# EAGLE design smduino (EAGLE 6.1)
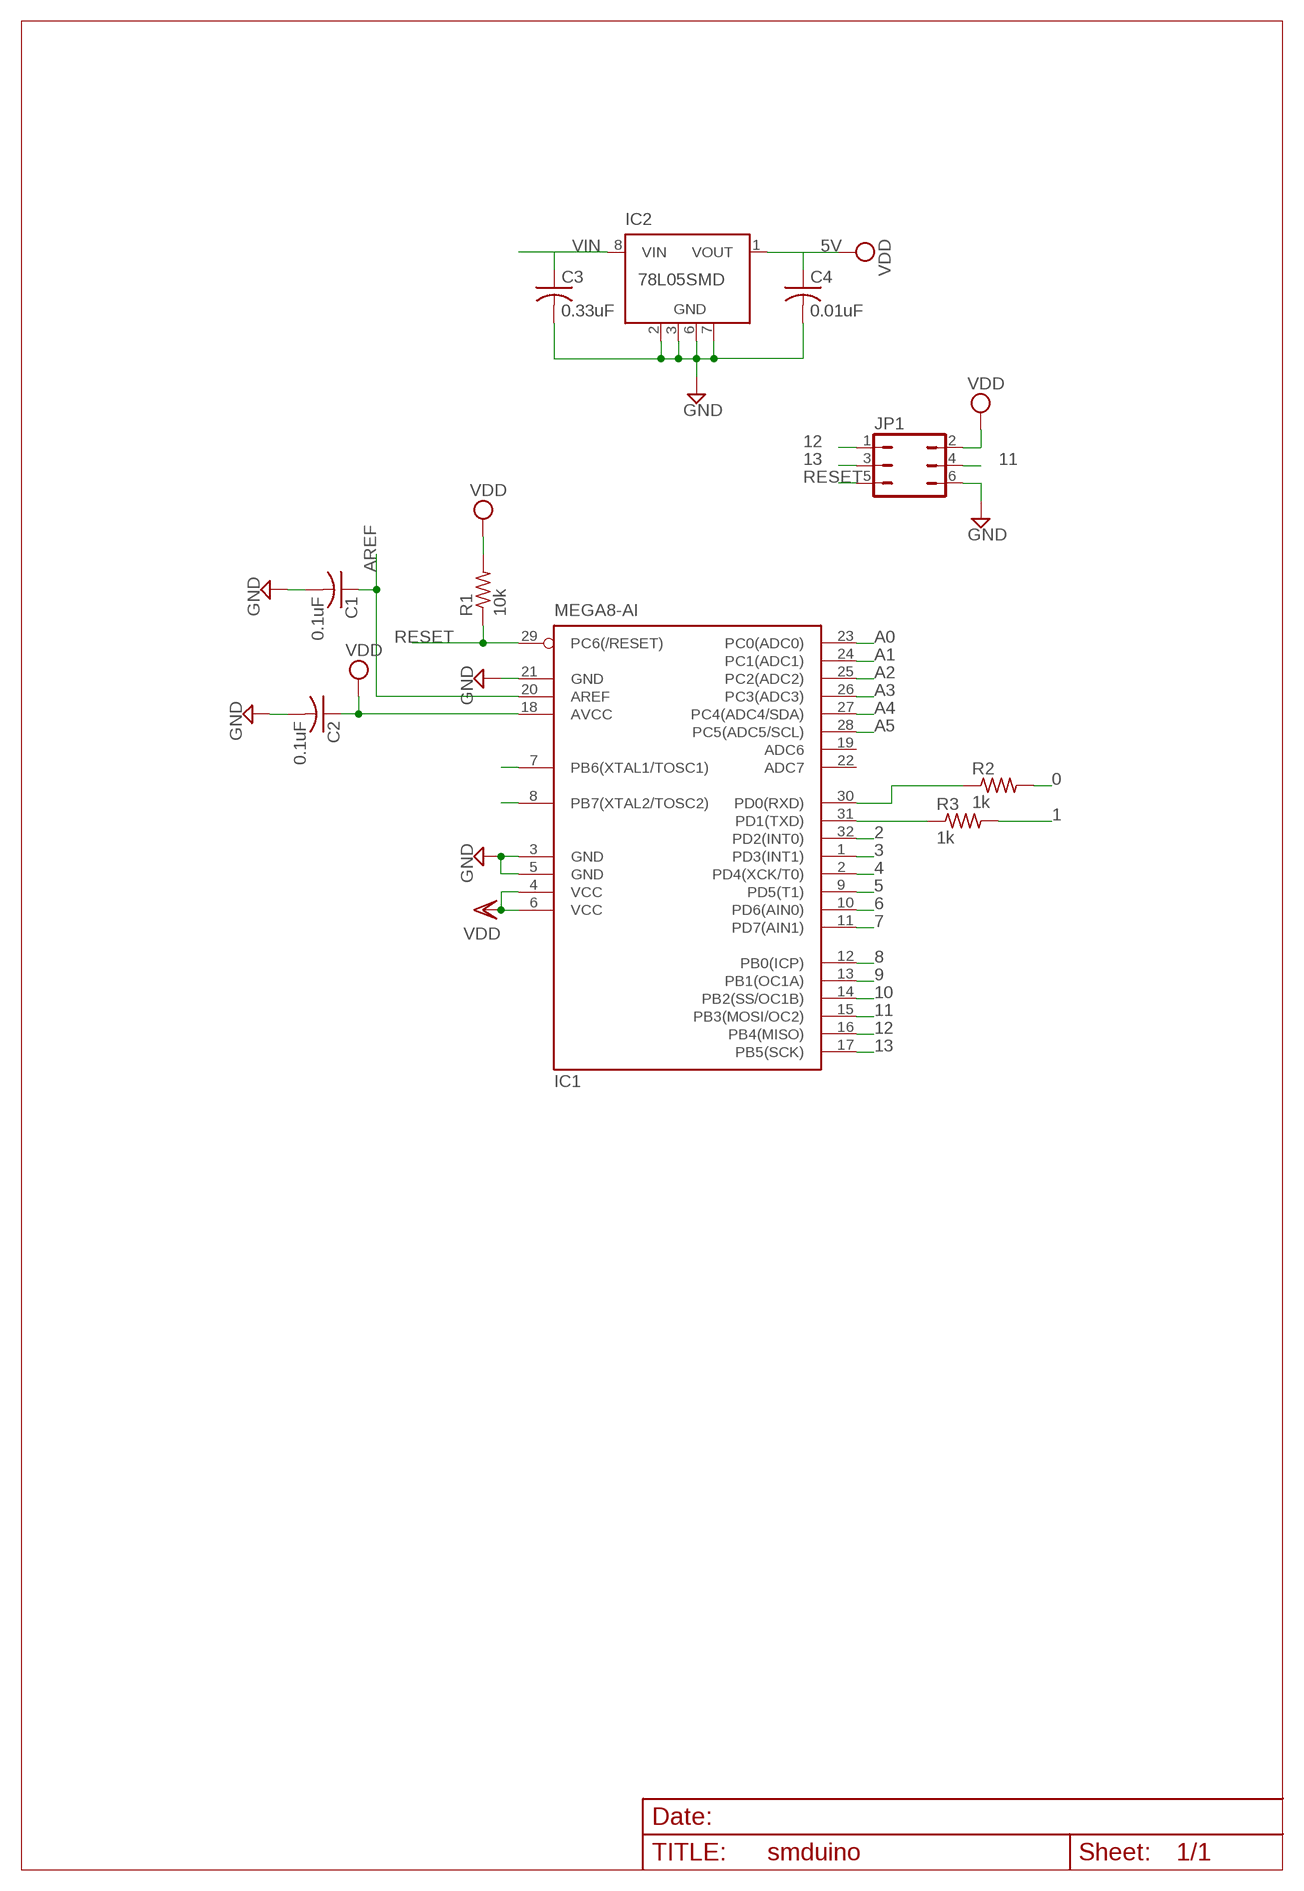
[diagram p0: schematic, sheet 1]

## Parts
C1  0.1uF  C-USC0603  [C0603]
C2  0.1uF  C-USC0603  [C0603]
C3  0.33uF  C-USC0603  [C0603]
C4  0.01uF  C-USC0603  [C0603]
IC1  MEGA8-AI  [TQFP32-08]
IC2  78L05SMD  [SO08]
JP1  JP3Q  [JP3Q]
R1  10k  R-US_R0603  [R0603]
R2  1k  R-US_R0603  [R0603]
R3  1k  R-US_R0603  [R0603]

## Nets
0: R2.2
1: R3.2
2: IC1.32(PD2(INT0))
3: IC1.1(PD3(INT1))
4: IC1.2(PD4(XCK/T0))
5: IC1.9(PD5(T1))
5V: C2.1 C4.1 IC1.4(VCC) IC1.6(VCC) IC1.18(AVCC) IC2.1(VOUT) JP1.2 R1.2 ; supply symbol labelled VDD
6: IC1.10(PD6(AIN0))
7: IC1.11(PD7(AIN1))
8: IC1.12(PB0(ICP))
9: IC1.13(PB1(OC1A))
10: IC1.14(PB2(SS/OC1B))
11: IC1.15(PB3(MOSI/OC2)) JP1.4
12: IC1.16(PB4(MISO)) JP1.1
13: IC1.17(PB5(SCK)) JP1.3
A0: IC1.23(PC0(ADC0))
A1: IC1.24(PC1(ADC1))
A2: IC1.25(PC2(ADC2))
A3: IC1.26(PC3(ADC3))
A4: IC1.27(PC4(ADC4/SDA))
A5: IC1.28(PC5(ADC5/SCL))
AREF: C1.1 IC1.20(AREF)
GND: C1.2 C2.2 C3.2 C4.2 IC1.3(GND) IC1.5(GND) IC1.21(GND) IC2.2(GND) IC2.3(GND) IC2.6(GND) IC2.7(GND) JP1.6
N$1: IC1.30(PD0(RXD)) R2.1
N$2: IC1.31(PD1(TXD)) R3.1
RESET: IC1.29(PC6(/RESET)) JP1.5 R1.1
VIN: C3.1 IC2.8(VIN)
XTAL1: IC1.7(PB6(XTAL1/TOSC1))
XTAL2: IC1.8(PB7(XTAL2/TOSC2))
Unconnected: IC1.19(ADC6) IC1.22(ADC7) IC2.4(NC) IC2.5(NC)

## Library data of the parts
C1-C4 = rcl:C-US: CAPACITOR, American symbol
IC1 = atmel:MEGA8: MICROCONTROLLER 8 Kbytes FLASH, 1 kbytes SRAM, 512 bytes EEPROM, USART, 6-channel 10 bit ADC, 2-channel 8 bit ADC Pin compatible with Atmega48, ATMega88, ATMega168 Source: avr.lbr; MPN: ATMEGA8-16AU; OC_FARNELL: 9171371; OC_NEWARK: 73M8863
IC2 = linear:78L*SMD: Positive VOLTAGE REGULATOR
JP1 = jumper:JP3Q: JUMPER
R1-R3 = rcl:R-US_: RESISTOR, American symbol

## Board
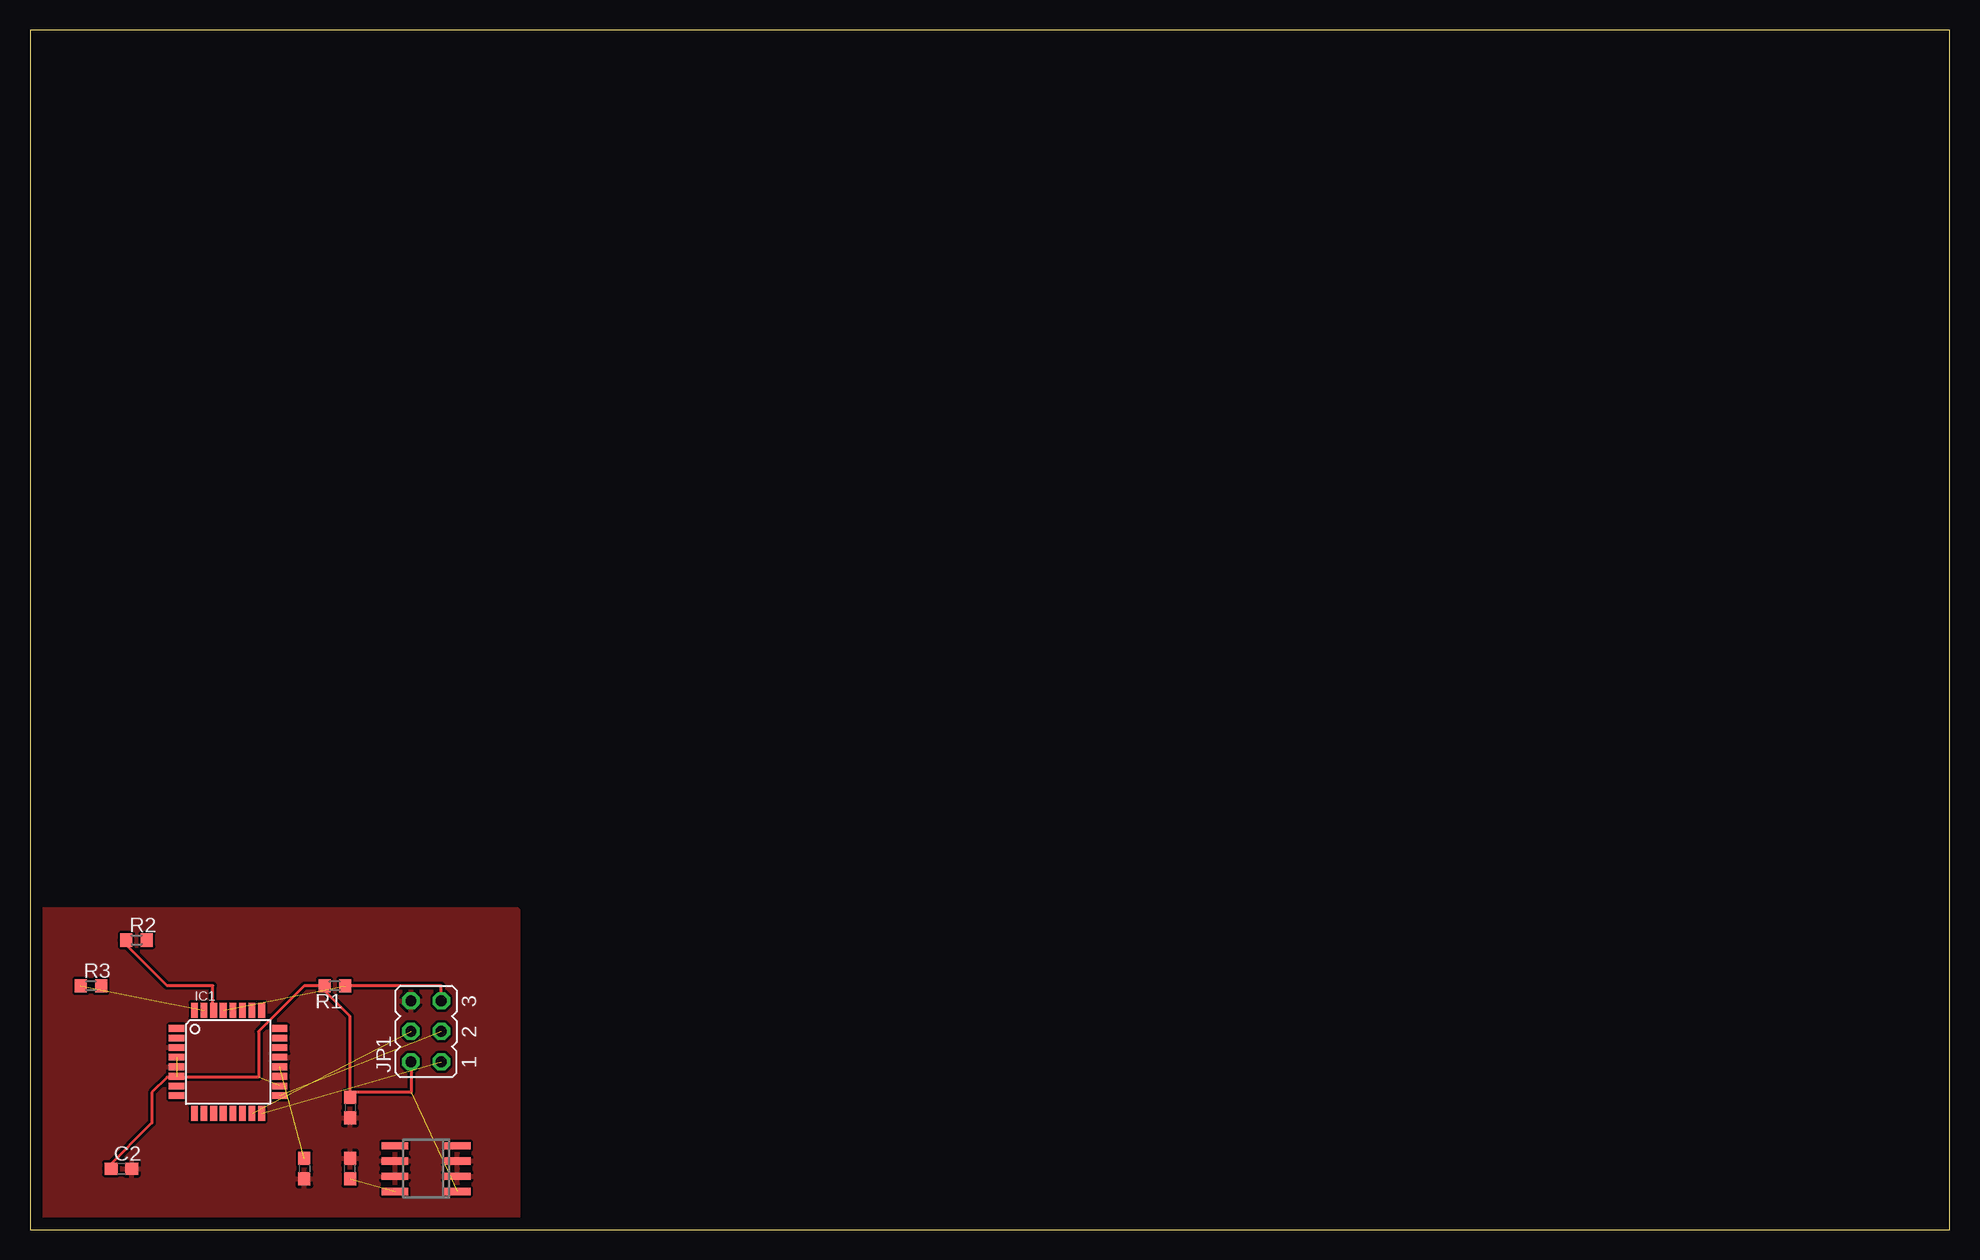
[diagram p1: board, top side]

Size 160 x 100 mm. Coordinates in mm from the lower left corner, seen from the top.
Outline: 0,0 160,0 160,100 0,100 0,0
Copper layers (1*16): Top 0.035mm / dielectric 1.5mm / Bottom 0.035mm
Design rules: minimum track width 10mil, minimum drill 24mil, track to track 8mil, track to pad 8mil, pad to pad 8mil, via to via 8mil, smd to smd 8mil, copper to edge 40mil, drill to drill 8mil, minimum pad ring 10mil, minimum via ring 8mil, stop-mask expansion 4mil, vias tented up to drill 0mil, thermal gap 10mil

### Footprints (pad centres in the part's own frame; a part is rotated, then mirrored left to right if it is on the bottom)
C0603 = smd 1.1 x 1: 1 -0.85,0; 2 0.85,0
TQFP32-08 = smd 1.27 x 0.559: 1 -4.293,2.8; 2 -4.293,2; 3 -4.293,1.2; 4 -4.293,0.4; 5 -4.293,-0.4; 6 -4.293,-1.2; 7 -4.293,-2; 8 -4.293,-2.8; 17 4.293,-2.8; 18 4.293,-2; 19 4.293,-1.2; 20 4.293,-0.4; 21 4.293,0.4; 22 4.293,1.2; 23 4.293,2; 24 4.293,2.8 | smd 0.559 x 1.27: 9 -2.8,-4.293; 10 -2,-4.293; 11 -1.2,-4.293; 12 -0.4,-4.293; 13 0.4,-4.293; 14 1.2,-4.293; 15 2,-4.293; 16 2.8,-4.293; 25 2.8,4.293; 26 2,4.293; 27 1.2,4.293; 28 0.4,4.293; 29 -0.4,4.293; 30 -1.2,4.293; 31 -2,4.293; 32 -2.8,4.293
SO08 = smd 0.6 x 2.2: 1 -1.905,-2.6; 2 -0.635,-2.6; 3 0.635,-2.6; 4 1.905,-2.6; 5 1.905,2.6; 6 0.635,2.6; 7 -0.635,2.6; 8 -1.905,2.6
JP3Q = drill 0.914 octagon: 1 -2.54,-1.27; 2 -2.54,1.27; 3 0,-1.27; 4 0,1.27; 5 2.54,-1.27; 6 2.54,1.27
R0603 = smd 1 x 1.1: 1 -0.85,0; 2 0.85,0

### Placement (x,y rotation side)
C1  22.86,5.08 270 top
C2  7.62,5.08 0 top
C3  26.67,5.08 90 top
C4  26.67,10.16 270 top
IC1  16.51,13.97 0 top
IC2  33.02,5.08 90 top
JP1  33.02,16.51 90 top
R1  25.4,20.32 180 top
R2  8.89,24.13 0 top
R3  5.08,20.32 0 top

### Tracks (layer width: path | path; a pad name or v marks a point on that pad's centre or on a via)
5V  (3 unrouted)
  Top 0.254: 12.7,12.7 11.43,12.7 10.16,11.43 10.16,8.89 6.35,5.08 C2.1 | 26.67,11.43 31.75,11.43 JP1.2 | 24.13,20.32 26.67,17.78 26.67,11.43 | 26.67,11.43 C4.1 | 12.7,12.7 19.05,12.7 19.05,16.51 22.86,20.32 24.13,20.32 | 12.7,12.7 IC1.6 | 24.13,20.32 R1.2
11  (1 unrouted)
12  (1 unrouted)
13  (1 unrouted)
AREF  (1 unrouted)
GND
  pour Top: 0,0 0,26.67 40.64,26.67 40.64,0
N$1
  Top 0.254: R2.1 7.62,24.13 11.43,20.32 15.24,20.32 15.24,17.78 IC1.30
N$2  (1 unrouted)
RESET  (1 unrouted)
  Top 0.254: R1.1 34.29,20.32 JP1.5
VIN  (1 unrouted)